# Altium schematic sheet TOP.SchDoc: Nano ESP32
size A3; Author: Silvio Navaretti; Revision: V0.3; SheetNumber: 1; SheetTotal: 1; RevAuthor: Silvio Navaretti
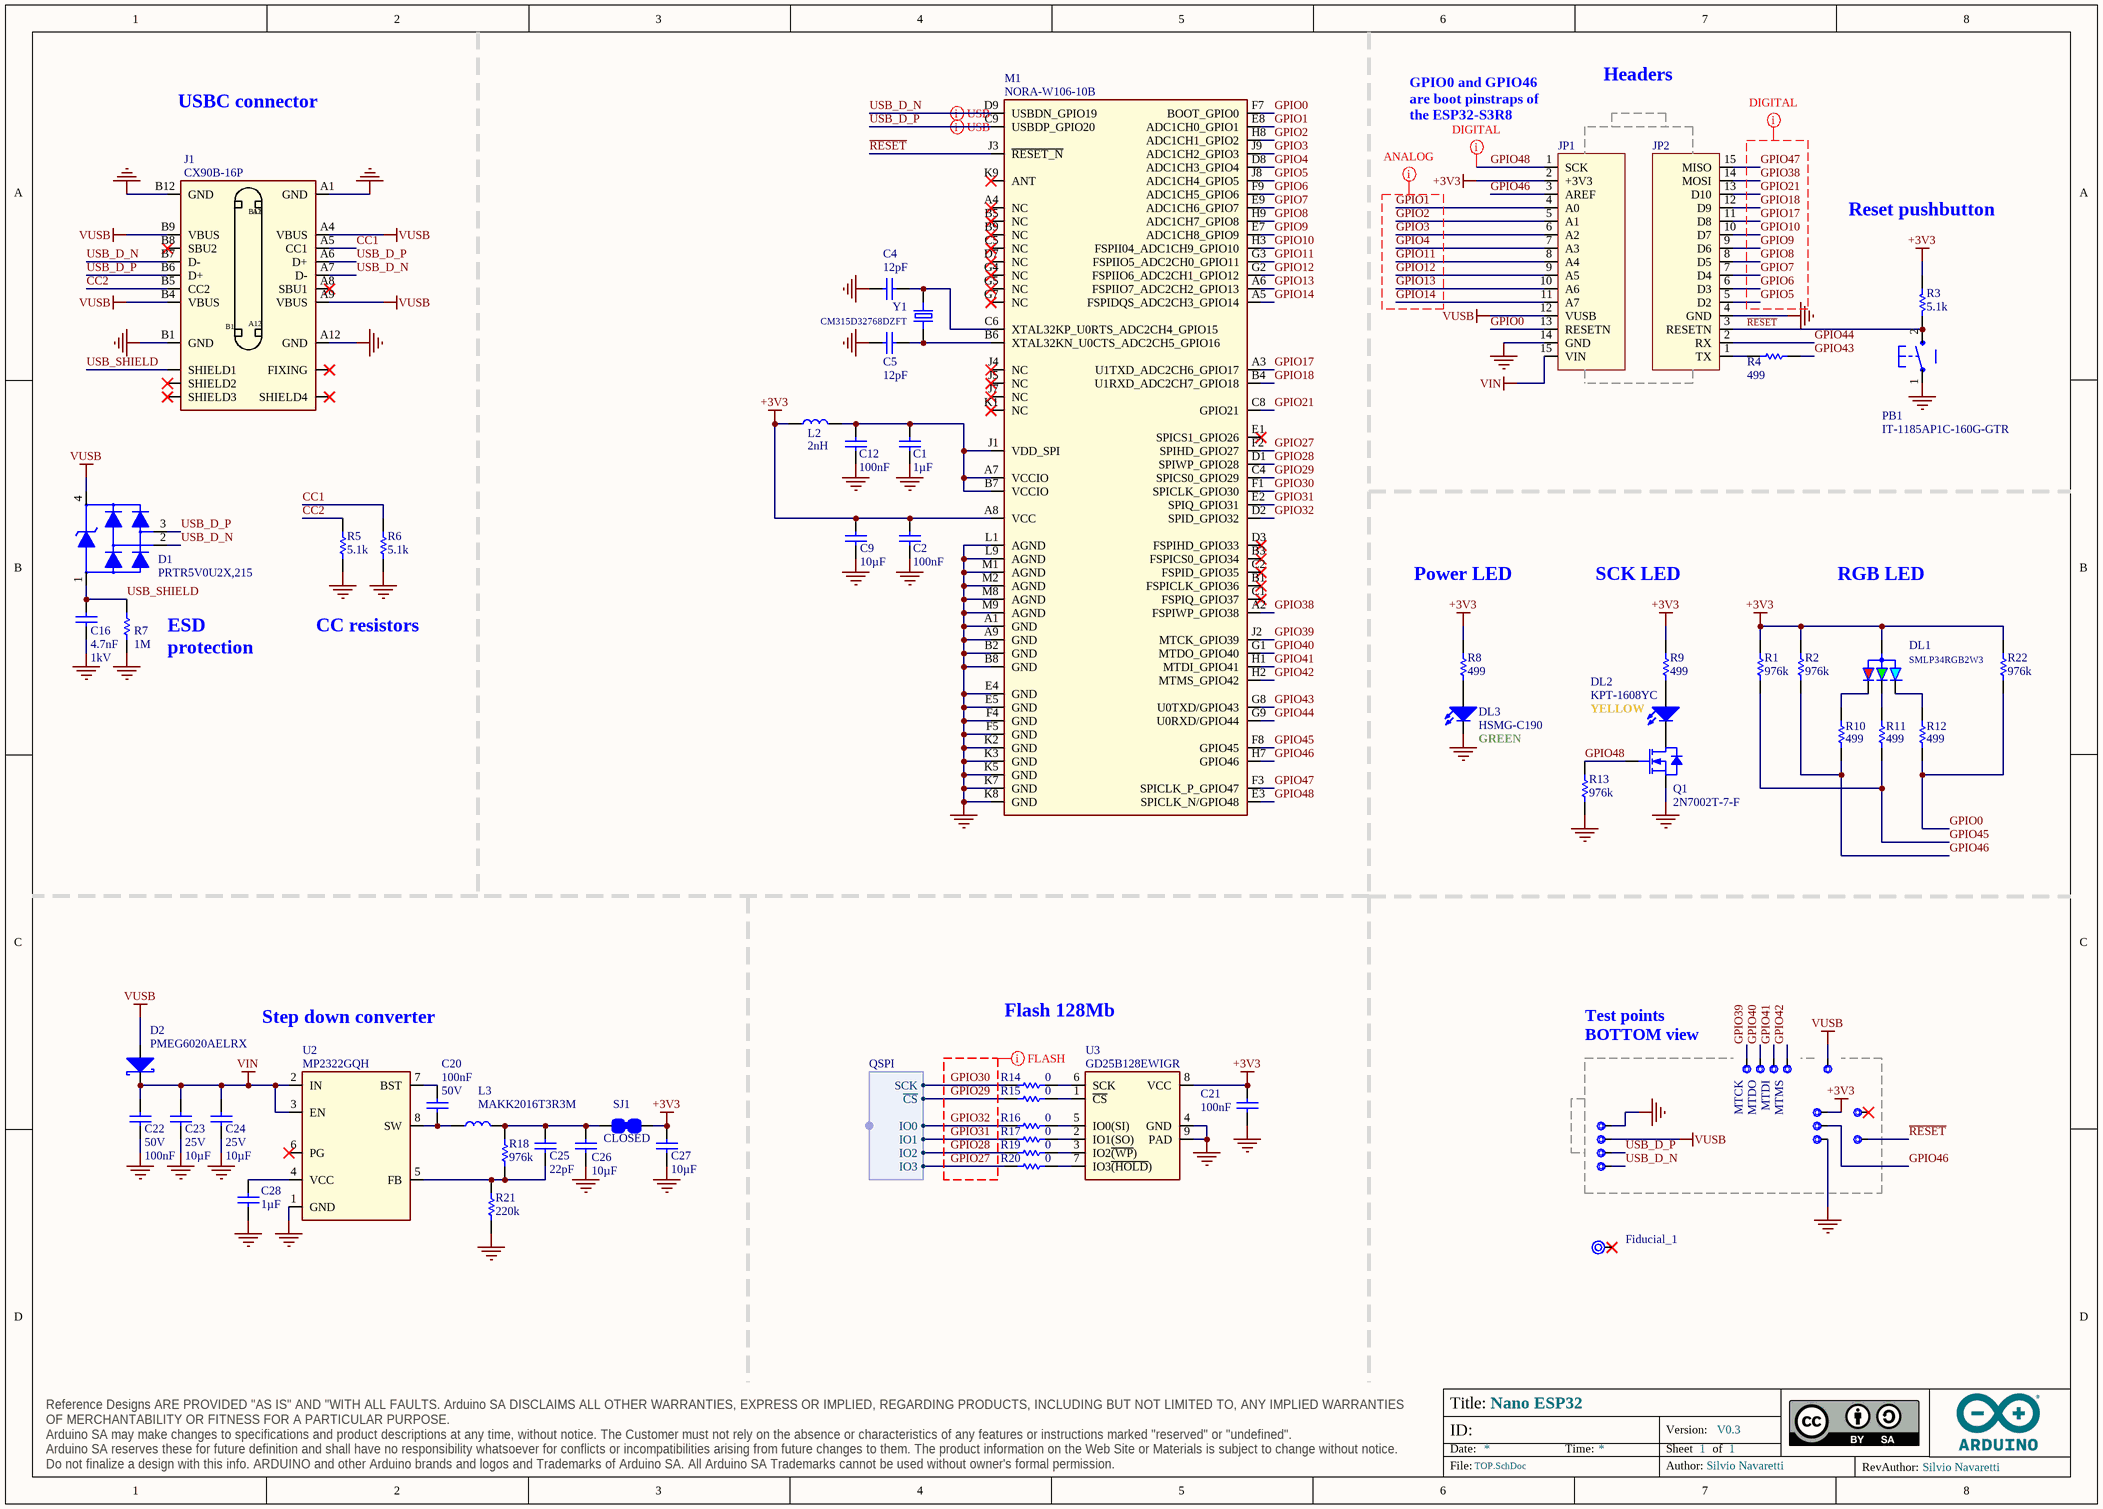
[diagram p0: TOP.SchDoc]

## Parts
3V3  CMP-018-0005-A.3  [TP-1.00MM]  (value not drawn)  (no BOM)
C1  value 1µF  [CAP-0201]  (hidden comment: GRM033R60J105MEA2D)
C2  value 100nF  [CAP-0402]  (hidden comment: GRM155R61H104KE19D)
C4  value 12pF  [CAP-0201]  (hidden comment: GRM0335C1E120JA01J)
C5  value 12pF  [CAP-0201]  (hidden comment: GRM0335C1E120JA01J)
C9  value 10µF  [CAP-0603]  (hidden comment: GRM188R61E106MA73J)
C12  value 100nF  [CAP-0402]  (hidden comment: GRM155R61H104KE19D)
C16  value 4.7nF  Voltage: 1kV  [CAP-0805]  (hidden comment: C0805C472KDRACTU)
C20  value 100nF  Voltage: 50V  [CAP-0402]  (hidden comment: GRM155R61H104KE19D)
C21  value 100nF  [CAP-0402]  (hidden comment: GRM155R61H104KE19D)
C22  value 100nF  Voltage: 50V  [CAP-0402]  (hidden comment: GRM155R61H104KE19D)
C23  value 10µF  Voltage: 25V  [CAP-0603]  (hidden comment: GRM188R61E106MA73J)
C24  value 10µF  Voltage: 25V  [CAP-0603]  (hidden comment: GRM188R61E106MA73J)
C25  value 22pF  [CAP-0402]  (hidden comment: C0402C220J5GAC7411)
C26  value 10µF  [CAP-0603]  (hidden comment: GRM188R61E106MA73J)
C27  value 10µF  [CAP-0603]  (hidden comment: GRM188R61E106MA73J)
C28  value 1µF  [CAP-0201]  (hidden comment: GRM033R60J105MEA2D)
D1  PRTR5V0U2X,215  [SOT190P230X110-4N]
D2  PMEG6020AELRX  [SOD123-1]
D+1  CMP-018-0005-A.3  [TP-1.00MM]  (value not drawn)  (no BOM)
D-1  CMP-018-0005-A.3  [TP-1.00MM]  (value not drawn)  (no BOM)
DL1  SMLP34RGB2W3  [SMLP34RGB2W]
DL2  KPT-1608YC  [LEDC1608X80N-AK]
DL3  HSMG-C190  [LEDC1608X80N-AK]
Fiducial_1  Fiducial mark 1mm with 2mm solder  [Fiducial mark 1mm with circle-Footprint-1]  (value not drawn)  (no BOM)
GND1  CMP-018-0005-A.3  [TP-1.00MM]  (value not drawn)  (no BOM)
GND2  CMP-018-0005-A.3  [TP-1.00MM]  (value not drawn)  (no BOM)
GPIO46  CMP-018-0005-A.3  [TP-1.00MM]  (value not drawn)  (no BOM)
J1  CX90B-16P  [CX90B-16P-Footprint-1]
JP1  PINHD-1X15-NANO-ANALOG-CASTELLATED  [PINHD-1X14_5VF]  (value not drawn)
JP2  PINHD-1X15-NANO-DIGITAL-CASTELLATED  [PINHD-1X14_5VF]  (value not drawn)
L2  Inductance: 2nH  [L-0402]  (hidden comment: BSCH001005052N0SCP)
L3  MAKK2016T3R3M  [MAKK2016T3R3M-Footprint-1]
M1  NORA-W106-10B  [NORA-W106-Footprint-1]
MTCK  CMP-018-0005-A.3  [TP-1.00MM]  (value not drawn)  (no BOM)
MTDI  CMP-018-0005-A.3  [TP-1.00MM]  (value not drawn)  (no BOM)
MTDO  CMP-018-0005-A.3  [TP-1.00MM]  (value not drawn)  (no BOM)
MTMS  CMP-018-0005-A.3  [TP-1.00MM]  (value not drawn)  (no BOM)
NC1  CMP-018-0005-A.3  [TP-1.00MM]  (value not drawn)  (no BOM)
NC2  CMP-018-0005-A.3  [TP-1.00MM]  (value not drawn)  (no BOM)
PB1  IT-1185AP1C-160G-GTR  [C&K_PTS820_NO_HOLES-1]
Q1  2N7002T-7-F  [SOT523]
R1  value 976k  [RES-0201]  (hidden comment: RMCF0201FT976K)
R2  value 976k  [RES-0201]  (hidden comment: RMCF0201FT976K)
R3  value 5.1k  [RES-0201]  (hidden comment: RC0201FR-075K1L)
R4  value 499  [RES-0201]  (hidden comment: CRCW0201499RFKED)
R5  value 5.1k  [RES-0201]  (hidden comment: RC0201FR-075K1L)
R6  value 5.1k  [RES-0201]  (hidden comment: RC0201FR-075K1L)
R7  value 1M  [RES-0402]  (hidden comment: CRCW04021M00FKED)
R8  value 499  [RES-0201]  (hidden comment: CRCW0201499RFKED)
R9  value 499  [RES-0201]  (hidden comment: CRCW0201499RFKED)
R10  value 499  [RES-0201]  (hidden comment: CRCW0201499RFKED)
R11  value 499  [RES-0201]  (hidden comment: CRCW0201499RFKED)
R12  value 499  [RES-0201]  (hidden comment: CRCW0201499RFKED)
R13  value 976k  [RES-0201]  (hidden comment: RMCF0201FT976K)
R14  value 0  [RES-0201]  (hidden comment: CRCW02010000Z0ED)
R15  value 0  [RES-0201]  (hidden comment: CRCW02010000Z0ED)
R16  value 0  [RES-0201]  (hidden comment: CRCW02010000Z0ED)
R17  value 0  [RES-0201]  (hidden comment: CRCW02010000Z0ED)
R18  value 976k  [RES-0201]  (hidden comment: RMCF0201FT976K)
R19  value 0  [RES-0201]  (hidden comment: CRCW02010000Z0ED)
R20  value 0  [RES-0201]  (hidden comment: CRCW02010000Z0ED)
R21  value 220k  [RES-0201]  (hidden comment: AC0201FR-07220KL)
R22  value 976k  [RES-0201]  (hidden comment: RMCF0201FT976K)
SJ1  SMD solder JUMPER CLOSED  [SJ]  (value not drawn)  (no BOM)
TP_VUSB  CMP-018-0005-A.3  [TP-1.00MM]  (value not drawn)  (no BOM)
U2  MP2322GQH  [QFN50P150X200X90-8L]
U3  GD25B128EWIGR  [PSON127P600X60_HS-9N]
VUSB  CMP-018-0005-A.3  [TP-1.00MM]  (value not drawn)  (no BOM)
Y1  CM315D32768DZFT  [ABS07]

## Harnesses
QSPI: SCK, ~{CS}, IO0, IO1, IO2, IO3

## Nets
+3V3: 3V3.X C2.2 C9.2 C21.2 C27.2 DL1.1(ANODE) JP1.2(+3V3) L2.1 M1.A8(VCC) R1.2 R2.2 R3.2 R8.2 R9.2 R22.2 SJ1.2 U3.8(VCC)
GND: C1.1 C2.1 C4.2 C5.2 C9.1 C12.1 C16.1 C21.1 C22.2 C23.1 C24.1 C26.1 C27.1 C28.1 DL3.C GND1.X GND2.X J1.A1(GND) J1.A12(GND) J1.B1(GND) J1.B12(GND) JP1.14(GND) JP2.4(GND) M1.A1(GND) M1.A9(GND) M1.B2(GND) M1.B8(GND) M1.E4(GND) M1.E5(GND) M1.F4(GND) M1.F5(GND) M1.K2(GND) M1.K3(GND) M1.K5(GND) M1.K7(GND) M1.K8(GND) M1.L1(AGND) M1.L9(AGND) M1.M1(AGND) M1.M2(AGND) M1.M8(AGND) M1.M9(AGND) PB1.1 Q1.S R5.1 R6.1 R7.1 R13.1 R21.1 U2.1(GND) U3.4(GND) U3.9(PAD)
VIN: C22.1 C23.2 C24.2 D2.C JP1.15(VIN) U2.2(IN) U2.3(EN)
VUSB: D1.4 D2.A J1.A4(VBUS) J1.A9(VBUS) J1.B4(VBUS) J1.B9(VBUS) JP1.12(VUSB) TP_VUSB.X VUSB.X
CC1: J1.A5(CC1) R6.2
CC2: J1.B5(CC2) R5.2
GPIO0: JP1.13(RESETN) M1.F7(BOOT_GPIO0) R12.1 R22.1
GPIO1: JP1.4(A0) M1.E8(ADC1CH0_GPIO1)
GPIO2: JP1.5(A1) M1.H8(ADC1CH1_GPIO2)
GPIO3: JP1.6(A2) M1.J9(ADC1CH2_GPIO3)
GPIO4: JP1.7(A3) M1.D8(ADC1CH3_GPIO4)
GPIO5: JP2.5(D2) M1.J8(ADC1CH4_GPIO5)
GPIO6: JP2.6(D3) M1.F9(ADC1CH5_GPIO6)
GPIO7: JP2.7(D4) M1.E9(ADC1CH6_GPIO7)
GPIO8: JP2.8(D5) M1.H9(ADC1CH7_GPIO8)
GPIO9: JP2.9(D6) M1.E7(ADC1CH8_GPIO9)
GPIO10: JP2.10(D7) M1.H3(FSPII04_ADC1CH9_GPIO10)
GPIO11: JP1.8(A4) M1.G3(FSPIIO5_ADC2CH0_GPIO11)
GPIO12: JP1.9(A5) M1.G2(FSPIIO6_ADC2CH1_GPIO12)
GPIO13: JP1.10(A6) M1.A6(FSPIIO7_ADC2CH2_GPIO13)
GPIO14: JP1.11(A7) M1.A5(FSPIDQS_ADC2CH3_GPIO14)
GPIO17: JP2.11(D8) M1.A3(U1TXD_ADC2CH6_GPIO17)
GPIO18: JP2.12(D9) M1.B4(U1RXD_ADC2CH7_GPIO18)
GPIO21: JP2.13(D10) M1.C8(GPIO21)
GPIO27: M1.F2(SPIHD_GPIO27) R20.1 ; harness QSPI.IO3
GPIO28: M1.D1(SPIWP_GPIO28) R19.1 ; harness QSPI.IO2
GPIO29: M1.C4(SPICS0_GPIO29) R15.1 ; harness QSPI.~{CS}
GPIO30: M1.F1(SPICLK_GPIO30) R14.1 ; harness QSPI.SCK
GPIO31: M1.E2(SPIQ_GPIO31) R17.1 ; harness QSPI.IO1
GPIO32: M1.D2(SPID_GPIO32) R16.1 ; harness QSPI.IO0
GPIO38: JP2.14(MOSI) M1.A2(FSPIWP_GPIO38)
GPIO39: M1.J2(MTCK_GPIO39) MTCK.X
GPIO40: M1.G1(MTDO_GPIO40) MTDO.X
GPIO41: M1.H1(MTDI_GPIO41) MTDI.X
GPIO42: M1.H2(MTMS_GPIO42) MTMS.X
GPIO43: M1.G8(U0TXD/GPIO43) R4.2
GPIO44: JP2.2(RX) M1.G9(U0RXD/GPIO44)
GPIO45: M1.F8(GPIO45) R1.1 R11.1
GPIO46: GPIO46.X JP1.3(AREF) M1.H7(GPIO46) R2.1 R10.1
GPIO47: JP2.15(MISO) M1.F3(SPICLK_P_GPIO47)
GPIO48: JP1.1(SCK) M1.E3(SPICLK_N/GPIO48) Q1.G R13.2
~{RESET}: JP2.3(RESETN) M1.J3(~{RESET_N}) NC2.X PB1.2 R3.1
USB_D_N: D1.2 D-1.X J1.A7(D-) J1.B7(D-) M1.D9(USBDN_GPIO19)
USB_D_P: D1.3 D+1.X J1.A6(D+) J1.B6(D+) M1.C9(USBDP_GPIO20)
USB_SHIELD: C16.2 D1.1 J1.SHIELD1 R7.2
NetC1_2: C1.2 C12.2 L2.2 M1.A7(VCCIO) M1.B7(VCCIO) M1.J1(VDD_SPI)
NetC4_1: C4.1 M1.C6(XTAL32KP_U0RTS_ADC2CH4_GPIO15) Y1.2
NetC5_1: C5.1 M1.B6(XTAL32KN_U0CTS_ADC2CH5_GPIO16) Y1.1
NetC20_1: C20.1 L3.1 U2.8(SW)
NetC20_2: C20.2 U2.7(BST)
NetC25_1: C25.1 R18.1 R21.2 U2.5(FB)
NetC25_2: C25.2 C26.2 L3.2 R18.2 SJ1.1
NetC28_2: C28.2 U2.4(VCC)
NetDL1_2: DL1.2(RED_C) R10.2
NetDL1_3: DL1.3(BLUE_C) R12.2
NetDL1_4: DL1.4(GREEN_C) R11.2
NetDL2_A: DL2.A R9.1
NetDL2_C: DL2.C Q1.D
NetDL3_A: DL3.A R8.1
NetJP2_1: JP2.1(TX) R4.1
NetR14_2: R14.2 U3.6(SCK)
NetR15_2: R15.2 U3.1(~{CS})
NetR16_2: R16.2 U3.5(IO0(SI))
NetR17_2: R17.2 U3.2(IO1(SO))
NetR19_2: R19.2 U3.3(IO2~{(WP}))
NetR20_2: R20.2 U3.7(IO3~{(HOLD}))

Not connected (* = marked no-connect by the designer): Fiducial_1 1*; J1 A8(SBU1)* B8(SBU2)* FIXING* SHIELD2* SHIELD3* SHIELD4*; M1 A4(NC)* B1(FSPICLK_GPIO36)* B3(FSPICS0_GPIO34)* B5(NC)* B9(NC)* C1(FSPIQ_GPIO37)* C2(FSPID_GPIO35)* C5(NC)* D3(FSPIHD_GPIO33)* D7(NC)* E1(SPICS1_GPIO26)* G4(NC)* G5(NC)* G7(NC)* J4(NC)* J5(NC)* J7(NC)* K1(NC)* K9(ANT)*; NC1 X*; U2 6(PG)*

## Layout directives
differential pair; differential pair class USB: USB_D_N, USB_D_P
net class FLASH: GPIO27, GPIO28, GPIO29, GPIO30, GPIO31, GPIO32
net class ANALOG: GPIO1, GPIO2, GPIO3, GPIO4, GPIO11, GPIO12, GPIO13, GPIO14
net class DIGITAL: GPIO5, GPIO6, GPIO7, GPIO8, GPIO9, GPIO10, GPIO17, GPIO18, GPIO21, GPIO38, GPIO47, GPIO48

## Notes on the sheet
- USBC connector
- Headers
- (near JP1) GPIO0 and GPIO46 are boot pinstraps of the ESP32-S3R8
- Reset pushbutton
- Power LED
- SCK LED
- RGB LED
- ESD
  protection
- CC resistors
- YELLOW
- (near DL3) GREEN
- Step down converter
- Flash 128Mb
- Test points BOTTOM view
- Title:
- ID:
- Date:
- Time:
- Version:
- Sheet
- of
- RevAuthor:
- Reference Designs ARE PROVIDED "AS IS" AND "WITH ALL FAULTS. Arduino SA DISCLAIMS ALL OTHER WARRANTIES, EXPRESS OR IMPLIED, REGARDING PRODUCTS, INCLUDING BUT NOT LIMITED TO, ANY IMPLIED WARRANTIES OF MERCHANTABILITY OR FITNESS FOR A PARTICULAR PURPOSE.
  Arduino SA may make changes to specifications and product descriptions at any time, without notice. The Customer must not rely on the absence or characteristics of any features or instructions marked "reserved" or "undefined".
  Arduino SA reserves these for future definition and shall have no responsibility whatsoever for conflicts or incompatibilities arising from future changes to them. The product information on the Web Site or Materials is subject to change without notice.
  Do not finalize a design with this info. ARDUINO and other Arduino brands and logos and Trademarks of Arduino SA. All Arduino SA Trademarks cannot be used without owner's formal permission.
- File:
- Author:

## Library data of the parts
3V3 D+1 D-1 GND1 GND2 GPIO46 MTCK MTDI MTDO MTMS NC1 NC2 TP_VUSB VUSB = UT0013-A.4: Test point 1.00mm; Source: ut.SchLib; Design Item ID: CMP-018-0005-A.3; Pin Count: 1
C1 C28 = C0002-A.12: CAP CHIP 0201 1uF 6.3V X5R 20%; Manufacturer: Murata; Code Arduino: A5520; Voltage: 6.3V; Dielectric: X5R; Part Number: GRM033R60J105MEA2D; Package: 0201; Tolerance: 20%; Case/Package: 0201; Case Code (Imperial): 0201; Case Code (Metric): 0603
C2 C12 C20-C22 = C0015-A.11: CAP CHIP 0402 100nF 50V X5R 10%; Manufacturer: Murata; Code Arduino: A5141; Dielectric: X5R; Part Number: GRM155R61H104KE19D; Package: 0402; Tolerance: 10%; Case/Package: 0402; Case Code (Imperial): 0402; Case Code (Metric): 1005
  C2 C12 C21: Voltage: 50V
C4 C5 = C0003-A.12: CAP CHIP 0201 12pF 25V C0G 5%; Manufacturer: Murata; Code Arduino: C0003; Part Number: GRM0335C1E120JA01J; Tolerance: 5%; Voltage: 25V; Dielectric: C0G; Package: 0201; Case/Package: 0201; Case Code (Imperial): 0201; Case Code (Metric): 0603
C9 C23 C24 C26 C27 = C0047-A.15: CAP CHIP 0603 10uF 25V X5R 20%; Manufacturer: Murata; Code Arduino: 2213; Case/Package: 0603; Package: 0603; Case Code (Metric): 1608; Part Number: GRM188R61E106MA73J; Dielectric: X5R; Tolerance: 20%; Case Code (Imperial): 0603
  C9 C26 C27: Voltage: 25V
C16 = C0059-A.11: CAP CHIP 0805 4.7nF 1000V X7R 10%; Manufacturer: KEMET; Code Arduino: 0689; Tolerance: 10%; Case Code (Imperial): 0805; Case/Package: 0805; Part Number: C0805C472KDRACTU; Case Code (Metric): 2012; Dielectric: X7R; Package: 0805
C25 = C0029-A.11: CAP CHIP 0402 22pF 50V C0G 5%; Manufacturer: KEMET; Code Arduino: 0137; Case Code (Imperial): 0402; Tolerance: 5%; Manufacturer Part Number 2: 04025A220JAT2A; Case/Package: 0402; Part Number: C0402C220J5GAC7411; Package: 0402; Manufacturer 2: AVX; Voltage: 50V; Case Code (Metric): 1005; Dielectric: C0G
D1 = D0025-A.5: TVS ARRAY 4LIN.8kV 1pF SOT143B; Manufacturer: Nexperia; Device Type: ESD protection; Code Arduino: 2209; Part Number: PRTR5V0U2X,215
D2 = D0026-A.6: DIODE SCHOTTKY SMD 2A 60V SOD123FL; Manufacturer: Nexperia; Manucturer Part Number 2: SS26L; Code Arduino: 2208; Forward Voltage: 0.6V; Manucturer 2: Hottech; RoHS Compliance: RoHS3; Part Number: PMEG6020AELRX; Device Type: Diode Schottky; Forward Current: 2A
DL1 = L0014-A.10: LED RGB DIFFUSED PICOLED SMD; Manufacturer: ROHM Semiconductor; Code Arduino: A5469; Forward Current: 20mA; Lens Style: Rectangular; Dominant Wavelength: 470nm; Forward Voltage: 3V; Test Current: 5mA; Luminous Intensity: 45mcd; Lens Color: White; Pin Count: 4; Part Number: SMLP34RGB2W3; Case/Package: 0404; Lens Transparency: Diffused; Number of Pins: 4; Mount: Surface Mount; Color: Blue,Green,Red; Packaging: Tape and Reel; Height: 0.25mm; Width: 1mm; Package Quantity: 1; Case Code (Imperial): 0404; Lead Free: Lead Free; Min Operating Temperature: -40°C; Max Operating Temperature: 85°C; Length: 1mm; REACH SVHC: Unknown; Case Code (Metric): 1010
DL2 = L0008-A.4: LED SMD 0603 GIA588   8mcd 120^; Manufacturer: Kingbright; Code Arduino: 2243; Part Number: KPT-1608YC; Pin Count: 2
DL3 = L0009-A.4: LED SMD 0603 GREEN/568 15mcd 120^; Manufacturer: Broadcom; Code Arduino: 2204; Part Number: HSMG-C190; Pin Count: 2
Fiducial_1 = UT0024-A.6
J1 = J0272-A.3: CONN RCPT USB3.1 TYPEC 16POS SMD; Manufacturer: Hirose; Code Arduino: J0272; Part Number: CX90B-16P
JP1 = J0158-A.2: CONN THD SOCKET F/1/D 15V JANALOG NANO-TYPE CASTELLATED; Code Arduino: A5563; Pin Count: 15
JP2 = J0183-A.1: CONN THD SOCKET F/1/D 15V JDIGITAL NANO-TYPE CASTELLATED; Code Arduino: A5564; Pin Count: 15
L2 = I0069-A.3: IND CHIP 0402 2nH +-0.3nH 400mA; Manufacturer: Pulse Electronics; Code Arduino: I0069; Series Resistance: 100mR; Test Frequency: 100MHz; Frequency: 8.1GHz; DC Resistance (DCR): 100m; Part Number: BSCH001005052N0SCP; Packaging: 0402; Case Code (Imperial): 0402; Current: 400mA
L3 = I0045-A.9: IND CHIP 0806 3.3 uH 20% 1.2A; Manufacturer: Taiyo Yuden; Max DC Current: 1.15A; Core Material: Metal; DC Resistance (DCR): 255mR; Code Arduino: I0045; Test Frequency: 2MHz; Inductance: 3.3µH; Shielding: Shielded; Value: 3.3µH; Max Operating Temperature: 105°C; Height - Seated (Max): 0.039inch; Halogen Free: Halogen Free; Device Type: Inductor; Min Operating Temperature: -40°C; Length: 0.079inch; Packaging: Tape and Reel; Termination: SMD/SMT; Mount: Surface Mount; Height: 1mm; Manufacturer 2: Murata; Saturation Current: 1.15A; Part Number: MAKK2016T3R3M; Package Quantity: 3000; Case Code (Imperial): 0806; Manufacturer Part Number 2: LQM2MPN3R3NG0L; Width: 1.6mm; Tolerance: 20%; Resistor Type: Wirewound; Case Code (Metric): 2016; Case/Package: 0806; Current Rating: 1.2A
M1 = M0028-A.9: MODULE WIFI +BLE5 ESP32-S3; Manufacturer: U-Blox; Code Arduino: M0028; Part Number: NORA-W106-10B
PB1 = B0001-A.7: PUSHBUTTON WHITE NO ANCHORS; Manufacturer: Switronic; Code Arduino: 0173; Color: White; Mount: SMT; Part Number: IT-1185AP1C-160G-GTR
Q1 = T0003-A.2: MOSFET N-CH 60V 115mA SOT523; Manufacturer: Diodes Inc.; Device Type: Mosfet N-CH SMD; Code Arduino: 2368; Pin Count: 3; Part Number: 2N7002T-7-F
R1 R2 R13 R18 R22 = R0198-A.11: RES CHIP 0201 976k 1/20W 1%; Manufacturer: Stackpole Electronics Inc; Power: 50mW; Code Arduino: R0198; Tolerance: 1%; Case Code (Metric): 0603; Part Number: RMCF0201FT976K; Case/Package: 0201; Case Code (Imperial): 0201
R3 = R0169-A.15: RES CHIP 0201 5.1k OHM 1/20W 1%; Manufacturer: Yageo; Code Arduino: R0169; Power: 50mW; Resistance: 5.1kR; Voltage Rating: 25V; Temperature Coefficient: 200ppm/°C; Part Number: RC0201FR-075K1L; Tolerance: 1%; Case/Package: 0201; Case Code (Imperial): 0201; Case Code (Metric): 0603; Height: 0.01inch; Width: 0.3mm; Military Standard: Not; Number of Terminations: 2; Max Operating Temperature: 125°C; Length: 0.6mm; Power Rating: 50mW; Termination: SMD/SMT; Features: Moisture Resistant; Lead Free: Lead Free; Max Power Dissipation: 50mW; Composition: Thick Film; Min Operating Temperature: -55°C; Depth: 0.3mm; Packaging: Tape and Reel
R4 = R0185-A.13: RES CHIP 0201 499R 1/20W 1%; Manufacturer: Vishay; Power: 50mW; Voltage Rating (DC): 30V; Code Arduino: R0185; Temperature Coefficient: 100ppm/°C; Width: 0.012inch; Lead Free: Lead Free; Min Operating Temperature: -55°C; Termination: SMD/SMT; Tolerance: 1%; Max Operating Temperature: 155°C; Height: 0.23mm; Package Quantity: 1; Contact Plating: Tin; Case Code (Metric): 0603; Resistance: 499R; Case Code (Imperial): 0201; Weight: 6E-06oz; Case/Package: 0201; Voltage Rating: 30V; Max Power Dissipation: 50mW; Radiation Hardening: No; Number of Terminations: 2; Packaging: Tape and Reel; Resistor Type: Thick Film; Length: 0.6mm; Power Rating: 50mW; Part Number: CRCW0201499RFKED; Depth: 0.3mm; Mount: Surface Mount
R5 R6 = R0169-A.15: RES CHIP 0201 5.1k OHM 1/20W 1%; Manufacturer: Yageo; Power: 50mW; Code Arduino: R0169; Resistance: 5.1kR; Voltage Rating: 25V; Temperature Coefficient: 200ppm/°C; Case Code (Metric): 0603; Case/Package: 0201; Case Code (Imperial): 0201; Part Number: RC0201FR-075K1L; Tolerance: 1%; Height: 0.01inch; Width: 0.3mm; Military Standard: Not; Number of Terminations: 2; Max Operating Temperature: 125°C; Length: 0.6mm; Power Rating: 50mW; Termination: SMD/SMT; Features: Moisture Resistant; Lead Free: Lead Free; Max Power Dissipation: 50mW; Composition: Thick Film; Min Operating Temperature: -55°C; Depth: 0.3mm; Packaging: Tape and Reel
R7 = R0058-A.15: RES CHIP 0402 1M 1% 1/16W; Manufacturer: Vishay; Power: 63mW; Code Arduino: 0139; Case/Package: 0402; Manufacturer Part Number 2: ERJ-2RKF1004X; Case Code (Imperial): 0402; Tolerance: 1%; Package: 0402; Manufacturer 2: Panasonic; Case Code (Metric): 1005; Part Number: CRCW04021M00FKED
R8 R9 = R0185-A.13: RES CHIP 0201 499R 1/20W 1%; Manufacturer: Vishay; Code Arduino: R0185; Power: 50mW; Voltage Rating (DC): 30V; Temperature Coefficient: 100ppm/°C; Part Number: CRCW0201499RFKED; Tolerance: 1%; Case/Package: 0201; Case Code (Imperial): 0201; Case Code (Metric): 0603; Length: 0.6mm; Width: 0.012inch; Lead Free: Lead Free; Min Operating Temperature: -55°C; Termination: SMD/SMT; Max Operating Temperature: 155°C; Height: 0.23mm; Package Quantity: 1; Contact Plating: Tin; Resistance: 499R; Weight: 6E-06oz; Voltage Rating: 30V; Max Power Dissipation: 50mW; Radiation Hardening: No; Number of Terminations: 2; Packaging: Tape and Reel; Resistor Type: Thick Film; Power Rating: 50mW; Depth: 0.3mm; Mount: Surface Mount
R10-R12 = R0185-A.13: RES CHIP 0201 499R 1/20W 1%; Manufacturer: Vishay; Power: 50mW; Code Arduino: R0185; Voltage Rating (DC): 30V; Temperature Coefficient: 100ppm/°C; Case Code (Imperial): 0201; Case Code (Metric): 0603; Case/Package: 0201; Tolerance: 1%; Part Number: CRCW0201499RFKED; Length: 0.6mm; Width: 0.012inch; Lead Free: Lead Free; Min Operating Temperature: -55°C; Termination: SMD/SMT; Max Operating Temperature: 155°C; Height: 0.23mm; Package Quantity: 1; Contact Plating: Tin; Resistance: 499R; Weight: 6E-06oz; Voltage Rating: 30V; Max Power Dissipation: 50mW; Radiation Hardening: No; Number of Terminations: 2; Packaging: Tape and Reel; Resistor Type: Thick Film; Power Rating: 50mW; Depth: 0.3mm; Mount: Surface Mount
R14-R17 R19 R20 = R0140-A.13: RES CHIP 0201 0R 1/20W 5%; Manufacturer: Vishay; Code Arduino: R0140; Power: 50mW; Case/Package: 0201; Length: 0.6mm; Tolerance: 5%; Part Number: CRCW02010000Z0ED; Case Code (Imperial): 0201; Case Code (Metric): 0603
R21 = R0199-A.11: RES CHIP 0201 220k 1% 1/20W; Manufacturer: Yageo; Code Arduino: R0199; Power: 50mW; Part Number: AC0201FR-07220KL; Case Code (Metric): 0603; Case/Package: 0201; Case Code (Imperial): 0201; Tolerance: 1%
SJ1 = UT0006-A.12: Solder Jumper shorted pads. This is not a component
U2 = U0072-A.6: IC STEP DOWN CONV 1A 22V QFN8; Manufacturer: Monolithic Power Systems; Code Arduino: U0072; Part Number: MP2322GQH; Device Type: STEP DOWN CONV; Pin Count: 8
U3 = U0297-A.2: IC FLASH 128MB 6DFN 3V; Manufacturer: Giga Devices; Code Arduino: U0297; Max Supply Voltage: 3.6V; Min Operating Temperature: -40°C; Min Supply Voltage: 3V; Pin Count: 8; Part Number: GD25B128EWIGR; Case/Package: HVSON; Max Operating Temperature: 85°C
Y1 = X0003-A.5: CRYSTAL 32.768kHz 20ppm 12.5pF SMD 1.6x0.9mm; Manufacturer: Citizen FineDevice; Series Resistance: 70kR; Code Arduino: 0213; Frequency Stability: 0.12%; Max Operating Temperature: 85°C; Min Operating Temperature: -40°C; Load Capacitance: 12.5pF; Frequency: 32.768kHz; Radiation Hardening: No; Part Number: CM315D32768DZFT; Frequency Tolerance: 20ppm